# EasyEDA Pro project compute-module-v101.eprj, board adc-frontend-dif
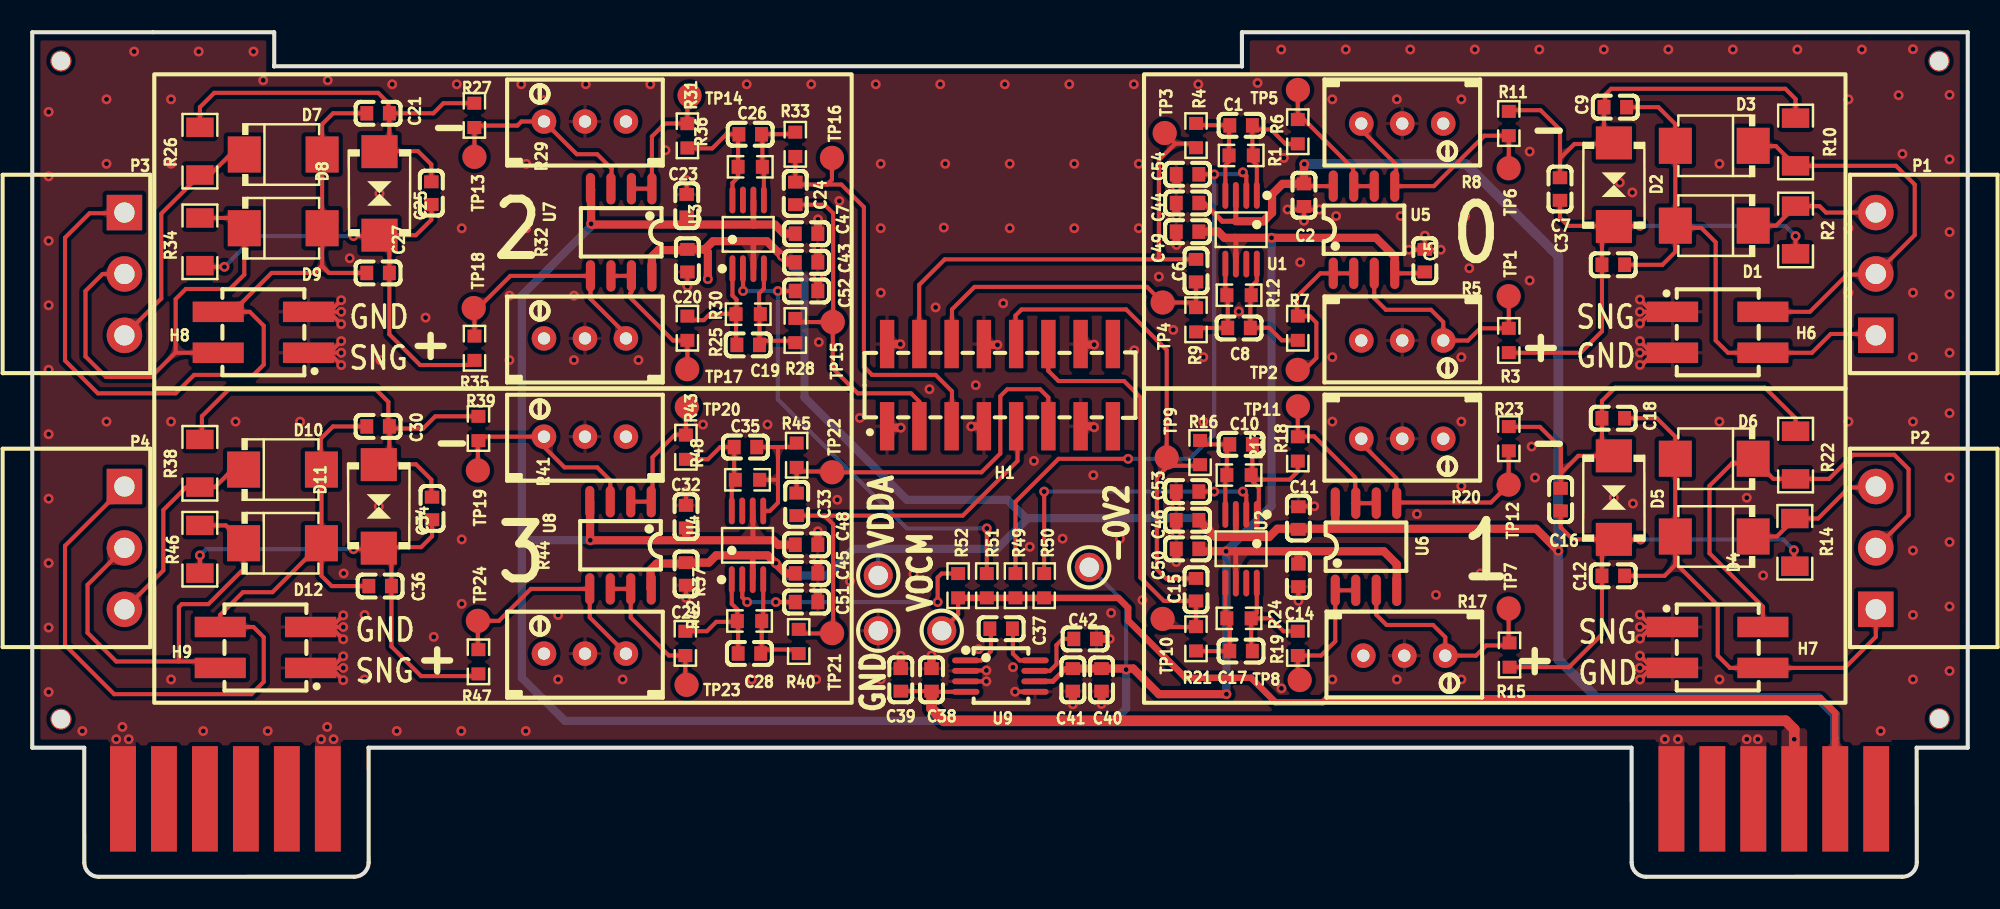
[diagram p10: board, top side]
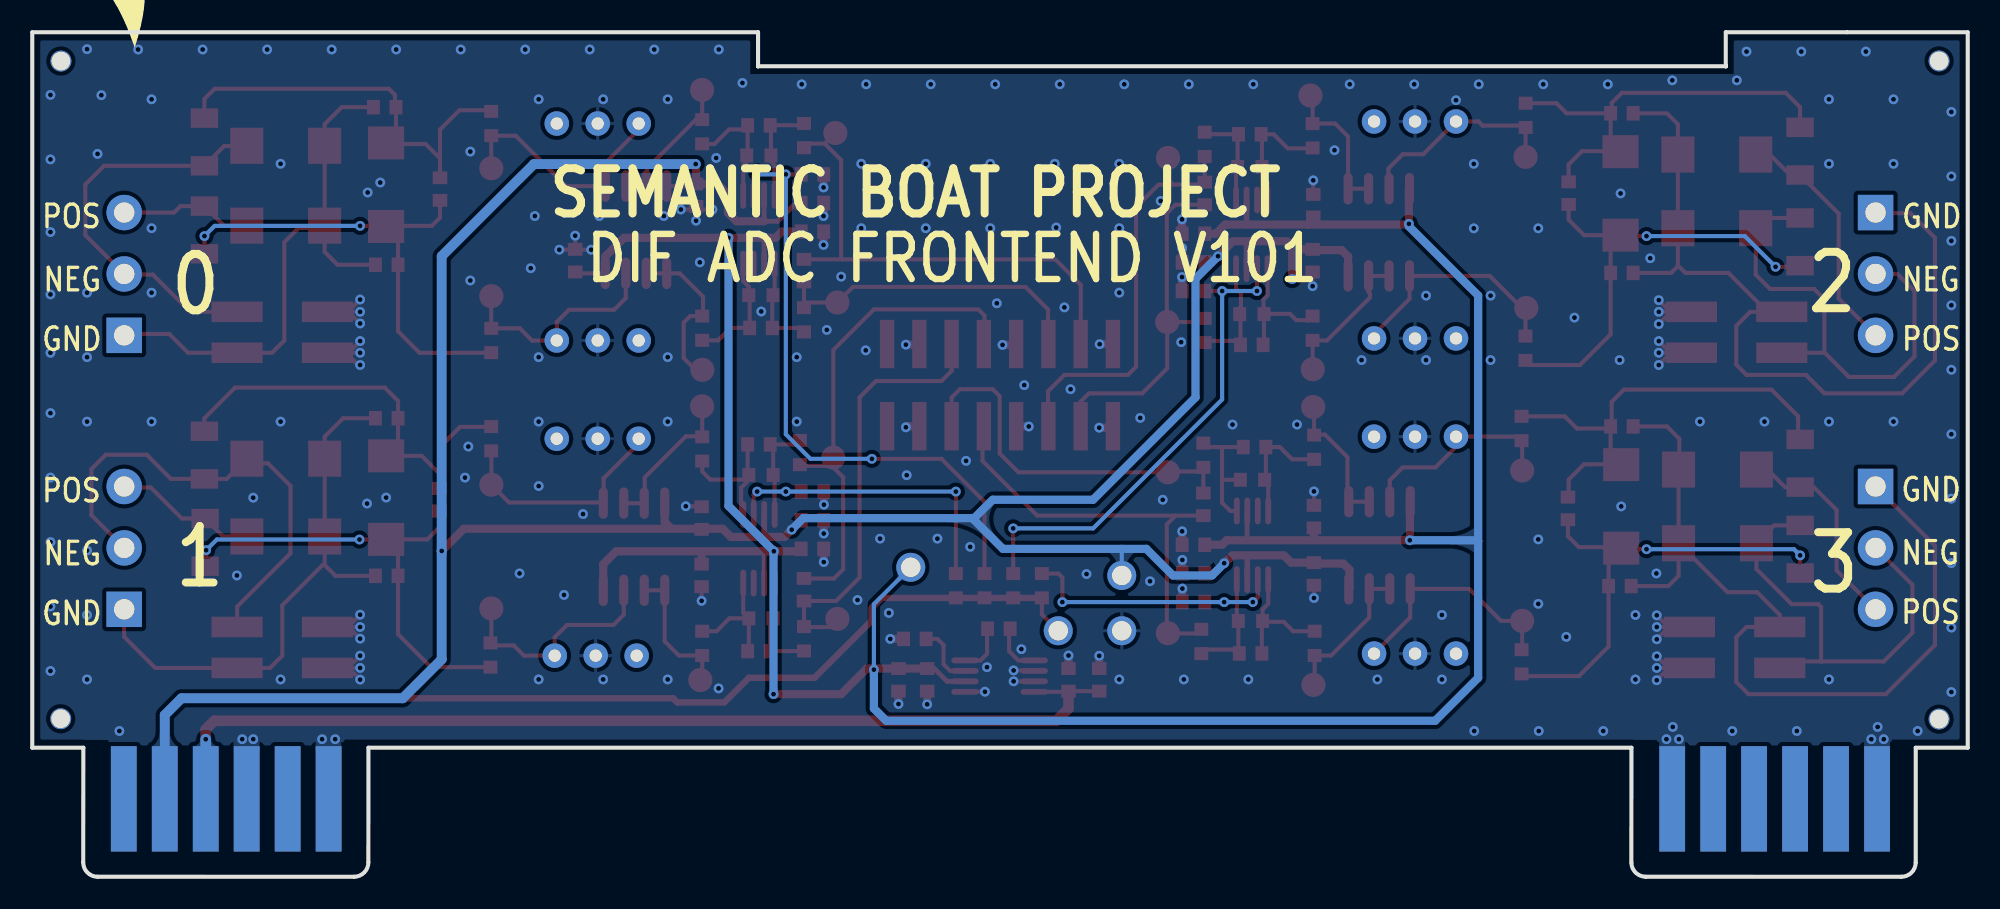
[diagram p11: board, bottom side, seen from below]

Outline 120 x 52.41 mm; copper layers: Top Layer, Inner1, Inner2, Bottom Layer. Coordinates in mm from the lower left corner of the outline.
Outline path: 75,50.3 15,50.3 15,52.41 0,52.41 0,8.01 3.22,8.01 3.23,0.89 arc(3.49,0.26) 4.11,0 19.96,0 arc(20.59,0.26) 20.86,0.89 20.85,8.01 99.16,8.01 99.16,0.89 arc(99.42,0.26) 100.05,0 115.95,0 arc(116.58,0.26) 116.84,0.89 116.83,8.01 120,8.01 120,52.41 75,52.41 75,50.3 ; 75,50.3 75,50.3 75,50.3
Stack: Top Layer 0.035mm Outer layer thickness 1oz / Dielectric1 0.2104mm 7628 RC49% 8.6mil / Inner1 0.0152mm Inner layer thickness / Dielectric2 1.065mm 1.1mm H/HOZ Copper / Inner2 0.0152mm Inner layer thickness / Dielectric3 0.2104mm 7628 RC49% 8.6mil / Bottom Layer 0.035mm Outer layer thickness 1oz

## Design rules (mm)
template: Custom Config
spacing copperThickness1oz (default): track to track 0.102, other pairs 0.152 to 0.3
spacing copperThickness2oz: track to track 0.203, other pairs 0.152 to 0.3
track width copperThickness1oz (default): min 0.127, default 0.254, max 2.54
track width copperThickness2oz: min 0.203, default 0.254, max 2.54
track width power: min 0.127, default 0.508, max 2.54
differential pair differentialPair (default): width min 0.127, default 0.254, max 2.54; gap min 0.152, default 0.152
via viaSize (default): diameter min 0.5, default 0.61, max 10; hole min 0.3, default 0.305, max 6.3
net GND uses power
net VOCM uses power
net VDDA uses power
net -0V23 uses power

## Placement (name value [footprint] x y rotation side)
C1  2.2nF  [C0603]  74.95 46.63 0 top
C2  100nF  [C0603]  78.84 42.3 270 top
C3  10nF  [C0603]  98.02 37.98 0 top
C5  100nF  [C0603]  86.34 38.23 90 top
C6  100pF  [C0603]  72.15 37.61 270 top
C7  10nF  [C0603]  94.72 42.68 270 top
C8  2.2nF  [C0603]  74.82 34.06 0 top
C9  10nF  [C0603]  98.15 47.76 180 top
C10  2.2nF  [C0603]  74.95 26.83 0 top
C11  100nF  [C0603]  78.5 22.26 90 top
C12  10nF  [C0603]  98.02 18.67 0 top
C14  100nF  [C0603]  78.5 18.7 270 top
C15  100pF  [C0603]  72.15 17.81 270 top
C16  10nF  [C0603]  94.76 23.4 270 top
C17  2.2nF  [C0603]  74.95 14 0 top
C18  10nF  [C0603]  98.02 28.45 180 top
C19  2.2nF  [C0603]  44.39 33.01 180 top
C20  100nF  [C0603]  40.62 38.23 270 top
C21  10nF  [C0603]  21.44 47.38 180 top
C23  100nF  [C0603]  40.58 41.64 90 top
C24  100pF  [C0603]  47.31 42.4 90 top
C25  10nF  [C0603]  24.74 42.42 90 top
C26  2.2nF  [C0603]  44.51 46.07 180 top
C27  10nF  [C0603]  21.44 37.47 0 top
C28  2.2nF  [C0603]  44.46 13.86 180 top
C29  100nF  [C0603]  40.53 18.79 270 top
C30  10nF  [C0603]  21.44 27.95 180 top
C32  100nF  [C0603]  40.53 22.35 90 top
C33  100pF  [C0603]  47.39 23.11 90 top
C34  10nF  [C0603]  24.79 22.86 90 top
C35  2.2nF  [C0603]  44.22 26.67 180 top
C36  10nF  [C0603]  21.57 18.04 0 top
C37  4.7uF  [C0603]  60.07 15.39 0 top
C38  10uF  [C0603]  55.75 12.22 270 top
C39  100nF  [C0603]  53.85 12.22 270 top
C40  470nF  [C0603]  66.29 12.22 90 top
C41  22uF  [C0603]  64.52 12.22 90 top
C42  22uF  [C0603]  65.28 14.76 180 top
C43  100nF  [C0603]  48.01 38.13 180 top
C44  100nF  [C0603]  71.63 41.81 0 top
C45  100nF  [C0603]  48.01 18.82 180 top
C46  100nF  [C0603]  71.63 22.13 0 top
C47  100nF  [C0603]  48.01 39.91 180 top
C48  100nF  [C0603]  48.01 20.6 180 top
C49  100nF  [C0603]  71.63 40.03 0 top
C50  100nF  [C0603]  71.63 20.35 0 top
C51  100nF  [C0603]  48.01 17.05 180 top
C52  100nF  [C0603]  48.01 36.35 180 top
C53  100nF  [C0603]  71.63 23.9 0 top
C54  100nF  [C0603]  71.63 43.59 0 top
D1  SMBJ28A  [SMB_L4.6-W3.6-LS5.4-RD]  104.28 40.41 180 top
D2  SMBJ28CA  [SMB_L4.6-W3.6-LS5.3-BI]  98.06 42.95 270 top
D3  SMBJ28A  [SMB_L4.6-W3.6-LS5.4-RD]  104.28 45.36 180 top
D4  SMBJ28A  [SMB_L4.6-W3.6-LS5.4-RD]  104.28 21.12 180 top
D5  SMBJ28CA  [SMB_L4.6-W3.6-LS5.3-BI]  98.06 23.53 270 top
D6  SMBJ28A  [SMB_L4.6-W3.6-LS5.4-RD]  104.28 25.94 180 top
D7  SMBJ28A  [SMB_L4.6-W3.6-LS5.4-RD]  15.56 44.82 0 top
D8  SMBJ28CA  [SMB_L4.6-W3.6-LS5.3-BI]  21.53 42.4 90 top
D9  SMBJ28A  [SMB_L4.6-W3.6-LS5.4-RD]  15.56 40.25 0 top
D10  SMBJ28A  [SMB_L4.6-W3.6-LS5.4-RD]  15.52 25.27 0 top
D11  SMBJ28CA  [SMB_L4.6-W3.6-LS5.3-BI]  21.48 22.98 90 top
D12  SMBJ28A  [SMB_L4.6-W3.6-LS5.4-RD]  15.52 20.7 0 top
H1  XDZ200-2-08-S-2.0-G1  [HDR-SMD_16P-P2.00-V-M-R2-C8-LS6.5]  60 30.51 0 top
H6  2.54-2*2P立贴针  [HDR-SMD_4P-P2.54-V-M-R2-C2-LS7.5]  104.5 33.79 270 top
H7  2.54-2*2P立贴针  [HDR-SMD_4P-P2.54-V-M-R2-C2-LS7.5]  104.5 14.23 270 top
H8  2.54-2*2P立贴针  [HDR-SMD_4P-P2.54-V-M-R2-C2-LS7.5]  14.33 33.79 90 top
H9  2.54-2*2P立贴针  [HDR-SMD_4P-P2.54-V-M-R2-C2-LS7.5]  14.46 14.23 90 top
NOREF  -  [Pad_e7469]  118.24 9.81 90 top
NOREF#2  -  [Pad_e7466]  1.78 9.78 0 top
NOREF#3  -  [Pad_e7468]  118.22 50.62 180 top
NOREF#4  -  [Pad_e7467]  1.78 50.62 270 top
P1  WJ15EDGRC-3.81-3P  [CONN-TH_3P-P3.81_WJ15EDGRC-3.81-3P]  114.3 37.41 90 top
P2  WJ15EDGRC-3.81-3P  [CONN-TH_3P-P3.81_WJ15EDGRC-3.81-3P]  114.3 20.41 90 top
P3  WJ15EDGRC-3.81-3P  [CONN-TH_3P-P3.81_WJ15EDGRC-3.81-3P]  5.72 37.41 270 top
P4  WJ15EDGRC-3.81-3P  [CONN-TH_3P-P3.81_WJ15EDGRC-3.81-3P]  5.72 20.41 270 top
R1  1kΩ  [R0603]  74.95 44.76 180 top
R2  100Ω  [R1206]  109.32 40.14 270 top
R3  1MΩ  [R0603]  91.54 33.28 90 top
R4  220Ω  [R0603]  72.15 45.99 90 top
R5  1MΩ  [RES-ADJ-TH_3296W]  84.94 33.28 270 top
R6  1kΩ  [R0603]  78.46 46.23 270 top
R7  1kΩ  [R0603]  78.46 34.04 270 top
R8  1MΩ  [RES-ADJ-TH_3296W]  84.94 46.74 270 top
R9  220Ω  [R0603]  72.15 34.56 270 top
R10  100Ω  [R1206]  109.32 45.6 90 top
R11  1MΩ  [R0603]  91.54 46.74 270 top
R12  1kΩ  [R0603]  74.82 36.09 180 top
R13  1kΩ  [R0603]  74.82 24.93 180 top
R14  100Ω  [R1206]  109.28 20.75 270 top
R15  1MΩ  [R0603]  91.59 13.76 90 top
R16  220Ω  [R0603]  72.41 26.32 90 top
R17  1MΩ  [RES-ADJ-TH_3296W]  85.07 13.72 270 top
R18  1kΩ  [R0603]  78.46 26.55 270 top
R19  1kΩ  [R0603]  78.46 14.48 90 top
R20  1MΩ  [RES-ADJ-TH_3296W]  84.94 27.18 270 top
R21  220Ω  [R0603]  72.15 14.77 270 top
R22  100Ω  [R1206]  109.32 26.17 90 top
R23  1MΩ  [R0603]  91.54 27.18 270 top
R24  1kΩ  [R0603]  74.82 16.04 180 top
R25  1kΩ  [R0603]  44.39 34.91 0 top
R26  100Ω  [R1206]  10.4 45.03 90 top
R27  1MΩ  [R0603]  27.41 47.25 270 top
R28  220Ω  [R0603]  47.31 33.9 270 top
R29  1MΩ  [RES-ADJ-TH_3296W]  34.27 46.87 90 top
R30  1kΩ  [R0603]  40.62 34.04 90 top
R31  1kΩ  [R0603]  40.62 45.98 270 top
R32  1MΩ  [RES-ADJ-TH_3296W]  34.27 33.41 90 top
R33  220Ω  [R0603]  47.31 45.45 90 top
R34  100Ω  [R1206]  10.4 39.4 270 top
R35  1MΩ  [R0603]  27.42 32.8 90 top
R36  1kΩ  [R0603]  44.51 44.06 0 top
R37  1kΩ  [R0603]  44.47 15.87 0 top
R38  100Ω  [R1206]  10.39 25.66 90 top
R39  1MΩ  [R0603]  27.66 27.82 270 top
R40  220Ω  [R0603]  47.52 14.6 270 top
R41  1MΩ  [RES-ADJ-TH_3296W]  34.27 27.31 90 top
R42  1kΩ  [R0603]  40.49 14.48 90 top
R43  1kΩ  [R0603]  40.53 26.66 270 top
R44  1MΩ  [RES-ADJ-TH_3296W]  34.27 13.85 90 top
R45  220Ω  [R0603]  47.39 26.16 90 top
R46  100Ω  [R1206]  10.39 20.33 270 top
R47  1MΩ  [R0603]  27.66 13.34 90 top
R48  1kΩ  [R0603]  44.34 24.63 0 top
R49  100Ω  [R0603]  60.96 18.06 270 top
R50  100Ω  [R0603]  62.74 18.06 270 top
R51  100Ω  [R0603]  59.18 18.06 270 top
R52  100Ω  [R0603]  57.4 18.06 270 top
TP1  -  [Test-Point-0.5mm]  91.54 36.03 180 top
TP2  -  [Test-Point-0.5mm]  78.46 31.46 180 top
TP3  -  [Test-Point-0.5mm]  70.21 46.15 180 top
TP4  -  [Test-Point-0.5mm]  70.08 35.63 180 top
TP5  -  [Test-Point-0.5mm]  78.47 48.83 180 top
TP6  -  [Test-Point-0.5mm]  91.54 43.96 180 top
TP7  -  [Test-Point-0.5mm]  91.54 16.65 180 top
TP8  -  [Test-Point-0.5mm]  78.58 12.21 180 top
TP9  -  [Test-Point-0.5mm]  70.33 26.01 180 top
TP10  -  [Test-Point-0.5mm]  70.08 16 180 top
TP11  -  [Test-Point-0.5mm]  78.47 29.19 180 top
TP12  -  [Test-Point-0.5mm]  91.54 24.33 180 top
TP13  -  [Test-Point-0.5mm]  27.42 44.67 0 top
TP14  -  [Test-Point-0.5mm]  40.75 48.48 0 top
TP15  -  [Test-Point-0.5mm]  49.63 34.42 0 top
TP16  -  [Test-Point-0.5mm]  49.58 44.61 0 top
TP17  -  [Test-Point-0.5mm]  40.61 31.49 0 top
TP18  -  [Test-Point-0.5mm]  27.37 35.29 0 top
TP19  -  [Test-Point-0.5mm]  27.63 25.21 0 top
TP20  -  [Test-Point-0.5mm]  40.58 29.15 0 top
TP21  -  [Test-Point-0.5mm]  49.59 15.11 0 top
TP22  -  [Test-Point-0.5mm]  49.59 25.1 0 top
TP23  -  [Test-Point-0.5mm]  40.57 11.91 0 top
TP24  -  [Test-Point-0.5mm]  27.63 15.88 0 top
TP25  RH-5004  [TESTPOINT_TH_BD2.5-D1.2]  52.45 18.7 270 top
TP26  RH-5004  [TESTPOINT_TH_BD2.5-D1.2]  56.39 15.27 270 top
TP27  RH-5004  [TESTPOINT_TH_BD2.5-D1.2]  65.53 19.2 270 top
TP28  RH-5004  [TESTPOINT_TH_BD2.5-D1.2]  52.45 15.27 270 top
U1  THS4521IDGKR  [VSSOP-8_L3.0-W3.0-P0.65-LS5.0-BL]  74.95 40.15 180 top
U2  THS4521IDGKR  [VSSOP-8_L3.0-W3.0-P0.65-LS5.0-BL]  74.95 20.35 180 top
U3  THS4521IDGKR  [VSSOP-8_L3.0-W3.0-P0.65-LS5.0-BL]  44.39 39.86 0 top
U4  THS4521IDGKR  [VSSOP-8_L3.0-W3.0-P0.65-LS5.0-BL]  44.34 20.57 0 top
U5  TLV9062IDR  [SOIC-8_L5.0-W4.0-P1.27-LS6.0-BL]  82.57 40.15 0 top
U6  TLV9062IDR  [SOIC-8_L5.0-W4.0-P1.27-LS6.0-BL]  82.69 20.48 0 top
U7  TLV9062IDR  [SOIC-8_L5.0-W4.0-P1.27-LS6.0-BL]  36.51 39.99 180 top
U8  TLV9062IDR  [SOIC-8_L5.0-W4.0-P1.27-LS6.0-BL]  36.47 20.57 180 top
U9  LM7705MM/NOPB  [MSOP-8_L3.0-W3.0-P0.65-LS5.0-BL]  60.02 12.45 270 top
U23  -  [ED12BGFBK-CARD]  108 0.01 0 top
U24  -  [ED12BGFBK-CARD]  12 0.01 0 top

## Footprints (pads in the part's own frame, mm; a bottom-side part is the same pattern mirrored in y, then rotated)
C0603
  rect 0.8x0.9 smd: 1(-0.7,0) 2(0.7,0)
CONN-TH_3P-P3.81_WJ15EDGRC-3.81-3P
  rect 2.2x2.2 hole 1.26: 1(-3.81,0)
  round 2.2 hole 1.26: 2(0,0) 3(3.81,0)
ED12BGFBK-CARD
  rect 1.6x6.54 smd far side: 1(-6.375,4.826) 2(-3.835,4.826) 3(-1.295,4.826) 4(1.245,4.826) 5(3.785,4.826) 6(6.325,4.826)
  rect 1.6x6.54 smd: 7(6.325,4.826) 8(3.785,4.826) 9(1.245,4.826) 10(-1.295,4.826) 11(-3.835,4.826) 12(-6.375,4.826)
HDR-SMD_4P-P2.54-V-M-R2-C2-LS7.5
  rect 1.27x3.17 smd: 1(-1.27,-2.8) 2(-1.27,2.8) 3(1.27,-2.8) 4(1.27,2.8)
HDR-SMD_16P-P2.00-V-M-R2-C8-LS6.5
  rect 0.89x3 smd: 1(-7,-2.55) 2(-7,2.55) 3(-5,-2.55) 4(-5,2.55) 5(-3,-2.55) 6(-3,2.55) 7(-1,-2.55) 8(-1,2.55) 9(1,-2.55) 10(1,2.55) 11(3,-2.55) 12(3,2.55) 13(5,-2.55) 14(5,2.55) 15(7,-2.55) 16(7,2.55)
MSOP-8_L3.0-W3.0-P0.65-LS5.0-BL
  oval 0.364x1.692 smd: 1(-0.975,-2.146) 2(-0.325,-2.146) 3(0.325,-2.146) 4(0.975,-2.146) 5(0.975,2.146) 6(0.325,2.146) 7(-0.325,2.146) 8(-0.975,2.146)
Pad_e7466
  round 1.3 hole 1.152: 1(0,0)
Pad_e7467
  round 1.3 hole 1.152: 1(0,0)
Pad_e7468
  round 1.3 hole 1.152: 1(0,0)
Pad_e7469
  round 1.3 hole 1.152: 1(0,0)
R0603
  rect 0.806x0.864 smd: 1(-0.753,0) 2(0.753,0)
R1206
  rect 1.208x1.701 smd: 1(-1.479,0) 2(1.479,0)
RES-ADJ-TH_3296W
  round 1.524 hole 0.762: 1(0,2.54) 2(0,0) 3(0,-2.54)
SMB_L4.6-W3.6-LS5.3-BI
  rect 2.047x2.241 smd: 1(-2.591,0) 2(2.591,0)
SMB_L4.6-W3.6-LS5.4-RD
  rect 2.047x2.241 smd: 1(-2.413,0) 2(2.413,0)
SOIC-8_L5.0-W4.0-P1.27-LS6.0-BL
  oval 0.569x1.95 smd: 1(-1.905,-2.705) 2(-0.635,-2.705) 3(0.635,-2.705) 4(1.905,-2.705) 5(1.905,2.705) 6(0.635,2.705) 7(-0.635,2.705) 8(-1.905,2.705)
Test-Point-0.5mm
  round 1.5 smd: 1(0,0)
TESTPOINT_TH_BD2.5-D1.2
  round 1.8 hole 1.2: 1(0,0)
VSSOP-8_L3.0-W3.0-P0.65-LS5.0-BL
  oval 0.364x1.662 smd: 1(-0.975,-2.131) 2(-0.325,-2.131) 3(0.325,-2.131) 4(0.975,-2.131) 5(0.975,2.131) 6(0.325,2.131) 7(-0.325,2.131) 8(-0.975,2.131)

## Nets
As in the schematic.

Pads without a net: H1 15 16; NOREF 1; NOREF#2 1; NOREF#3 1; NOREF#4 1; R5 3; R8 1; R17 3; R20 1; R29 3; R32 1; R41 3; R44 1; U1 7; U2 7; U3 7; U4 7; U23 2 6 7 11; U24 2 3 4 5 8 9 10 11

## Via types
v1: diameter 0.61, hole 0.305, Top Layer to Bottom Layer, 282 vias

## Routing (per net, layer and track width the routed paths; a pad name or vN(x,y) marks a point on that pad's centre or on a via; arc(x,y) is an arc through that point)
+3V3: length 67.2
  Top Layer w0.254: U9.4 55.8,11.48 C38.2 C39.2
  Top Layer w0.66: C38.2 55.75,10.44 56.51,9.68 108.71,9.68 109.25,9.15 v1(109.25,8.54) U23.4
  Bottom Layer w0.66: U23.4 v1(109.25,8.54)
-0V23: length 194.5
  Top Layer w0.254: C5.1 86.25,37.45 U5.4
  Top Layer w0.305: 44.68,20.96 44.68,22.69 U4.6 ; U1.6 74.62,39.61 74.59,39.65 ; 74.62,20.2 U2.6 ; U9.6 63.28,12.13 64.07,12.92 C41.2
  Top Layer w0.35: 44.73,40.47 44.71,40.49 U3.6
  Top Layer w0.508: U5.4 84.47,38.49 83.31,39.65 73.92,39.65 73.53,40.03 C49.2 ; 78.51,20.2 v1(74.02,20.2) 72.48,20.2 C50.2 ; 78.51,20.2 78.5,20.19 C14.1 ; 78.51,20.2 83.8,20.2 84.6,19.4 U6.4 ; C41.2 C40.2 68.26,12.92 69.85,11.33 v1(74.04,11.33) ; C23.1 40.58,40.82 40.92,40.47 ; C32.1 40.53,20.98 ; U8.4 34.58,23.26 34.58,20.89 v1(34.59,20.88) 45.95,20.88 46.23,20.6 C48.2 ; C47.2 46.61,39.91 46.04,40.47 40.92,40.47 ; 40.92,40.47 34.69,40.47 v1(34.65,40.52) 34.65,42.66 U7.4
  Bottom Layer w0.254: v1(67.82,12.85) 67.82,16.92 TP27.1
  Bottom Layer w0.508: v1(67.82,12.85) 67.82,10.44 67.06,9.68 33.02,9.68 30.35,12.35 30.35,20.82 ; v1(76.84,39.65) 76.84,23.01 v1(74.02,20.2) 74.04,20.18 v1(74.04,11.33) ; v1(34.65,40.52) 34.65,40.37 30.35,36.07 30.35,20.82 ; 30.35,20.82 30.42,20.88 v1(34.59,20.88)
GND: length 67.2
  Top Layer w0.254: v1(19.28,13.68) 18.56,12.96 ; 18.56,12.96 v1(19.28,12.96) ; 18.56,12.96 18.52,12.96 ; C2.2 79.03,41.41 v1(79.79,41.41) ; C2.2 v1(78.84,40.71) ; C2.2 78.66,41.41 v1(77.83,41.41) ; 18.52,12.96 H9.1 ; 18.52,12.96 v1(19.28,12.2) ; v1(19.16,31.76) 18.39,32.52 ; 18.39,32.52 18.43,32.52 ; 18.39,32.52 H8.1 ; 18.52,15.5 H9.3 ; 18.52,15.5 18.56,15.5 ; 18.52,15.5 v1(19.28,14.74) ; 18.43,32.52 v1(19.16,32.52) ; 18.43,32.52 v1(19.16,33.24) ; v1(86.34,39.78) C5.2 ; C5.2 86.32,38.91 v1(85.35,38.91) ; C5.2 86.36,38.91 v1(87.32,38.91) ; U9.5 62.16,11.48 v1(60.93,11.48) ; 18.56,15.5 v1(19.28,15.5) ; 18.56,15.5 v1(19.28,16.22) ; v1(99.67,34.33) 100.4,35.06 v1(99.67,35.06) ; 100.44,12.96 101.7,12.96 ; 100.44,12.96 v1(99.67,13.72) ; 100.44,12.96 100.4,12.96 ; v1(99.67,12.96) 100.4,12.96 ; 100.4,12.96 v1(99.67,12.24) ; 18.43,35.06 18.39,35.06 ; 18.43,35.06 v1(19.16,35.06) ; 18.43,35.06 v1(19.16,35.78) ; 18.39,35.06 H8.3 ; 18.39,35.06 v1(19.16,34.3) ; v1(79.48,22.99) 78.53,22.99 C11.2 ; 59.16,12.13 U9.3 ; v1(40.58,43.22) C23.2 ; 100.4,32.52 100.56,32.52 ; 100.4,32.52 v1(99.67,32.52) ; 100.4,32.52 v1(99.67,33.24) ; 100.56,32.52 99.8,31.76 v1(99.67,31.76) ; 100.56,32.52 101.7,32.52 ; v1(40.53,17.3) C29.2 ; v1(99.67,35.82) 100.44,35.06 101.7,35.06 ; v1(99.67,16.26) 100.44,15.5 101.7,15.5 ; U9.2 57.91,12.8 v1(59.16,12.8) ; v1(99.67,14.78) 100.4,15.5 v1(99.67,15.5) ; v1(78.5,17.12) C14.2 ; v1(40.53,23.91) C32.2 ; v1(40.62,36.65) C20.2
  Top Layer w0.508: v1(70.93,21.3) C46.1 ; v1(70.93,19.53) C50.1 ; C51.1 48.71,17.87 v1(48.69,17.88) ; v1(53.85,13.71) C39.1 ; H1.2 53.81,33.06 v1(53.82,33.05) ; v1(48.71,39.01) C43.1 ; C53.1 70.92,23.89 v1(70.92,23.09) ; v1(48.72,37.21) 48.72,36.36 C52.1 ; v1(48.71,21.44) C48.1 ; C49.1 70.94,40.02 v1(70.94,39.21) ; H1.7 58.23,27.96 v1(58.22,27.94) ; v1(65.84,33.02) 65.04,33.02 H1.14 ; C54.1 70.94,43.57 v1(70.94,42.78) ; v1(64.52,10.7) C41.1 ; v1(66.8,14.76) C42.1 ; H1.13 65.77,27.96 v1(65.84,27.89) ; v1(59.84,33.01) 59.05,33.01 H1.8 ; v1(66.29,10.72) C40.1 ; v1(48.72,40.79) 48.72,39.92 C47.1 ; C44.1 70.93,41.01 v1(70.94,41) ; v1(55.75,13.73) C38.1 ; v1(48.69,19.66) 48.71,19.65 C45.1 ; H1.1 53.09,27.87 v1(53.85,27.87)
  vias: v1(1.02,47.46) v1(1.02,43.46) v1(1.02,39.46) v1(1.02,35.46) v1(1.02,31.46) v1(1.02,27.46) v1(1.02,23.46) v1(1.02,19.46) v1(1.02,15.46) v1(1.02,11.46) v1(3.11,9.04) v1(4.6,48.25) v1(4.6,44.25) v1(4.6,28.25) v1(5.21,8.54) v1(5.59,9.3) v1(5.98,8.54) v1(6.32,51.21) v1(8.6,48.25) v1(8.6,44.25) v1(8.6,28.25) v1(8.6,12.25) v1(10.32,51.21) v1(10.6,9.04) v1(12.6,28.25) v1(13.72,51.21) v1(14.32,49.42) v1(14.6,9.04) v1(16.6,28.25) v1(17.91,8.54) v1(18.32,49.42) v1(18.29,9.3) v1(18.68,8.54) v1(19.3,18.82) v1(19.69,38.38) v1(20.6,16.25) v1(20.6,12.25) v1(21.53,42.4) v1(21.48,22.98) v1(21.58,32.06) v1(22.32,49.18) v1(22.6,9.04) v1(24.38,34.7) v1(24.89,14.89) v1(26.32,49.18) v1(26.63,40.24) v1(26.63,20.94) v1(26.63,16.94) v1(26.6,9.04) v1(29.58,36.06) v1(29.58,32.06) v1(30.32,49.18) v1(30.63,44.24) v1(30.63,40.24) v1(30.6,9.04) v1(31.73,48.19) v1(32.6,16.25) v1(32.6,12.25) v1(33.58,36.06) v1(33.58,32.06) v1(34.32,49.18) v1(36.6,12.25) v1(37.58,32.06) v1(38.32,49.18) v1(39.26,45.08) v1(41.59,28.06) v1(44.3,49.18) v1(44.6,12.25) v1(45.59,28.06) v1(48.3,49.18) v1(48.6,12.25) v1(48.77,33.17) v1(49.91,23.4) v1(50.04,41.94) v1(50.7,18.34) v1(51.31,28.48) v1(52.3,49.18) v1(52.6,44.25) v1(52.6,40.25) v1(52.6,36.25) v1(52.6,12.25) v1(54.64,18.79) v1(55.63,30.25) v1(56.01,35.33) v1(56.3,49.18) v1(56.51,40.29) v1(56.6,44.25) v1(58.5,30.51) v1(58.67,14.12) v1(59.16,12.13) v1(60.2,35.59) v1(60.3,49.18) v1(60.6,44.25) v1(60.6,40.25) v1(60.81,13.01) v1(61.85,20.47) v1(62.1,25.81) v1(63.88,20.98) v1(64.3,49.18) v1(64.6,44.25) v1(64.6,40.25) v1(65.79,24.92) v1(66.89,16.37) v1(67.44,20.98) v1(68.3,49.18) v1(68.33,32.67) v1(68.6,44.25) v1(68.6,40.25) v1(68.83,17.17) v1(69.85,37.24) v1(70.74,33.94) v1(72.3,49.18) v1(72.6,32.25) v1(72.6,28.25) v1(74.8,35.08) v1(75.97,49.26) v1(77.44,51.34) v1(77.45,11.69) v1(77.6,44.6) v1(78.61,38.13) v1(80.6,48.25) v1(80.6,32.25) v1(80.6,28.25) v1(80.6,12.25) v1(80.84,41) v1(81.44,51.34) v1(84.6,48.25) v1(84.6,12.25) v1(84.84,41) v1(85.44,51.34) v1(85.85,22.51) v1(87.03,17.49) v1(88.6,48.25) v1(88.6,32.25) v1(88.6,28.25) v1(88.6,24.25) v1(88.6,12.25) v1(88.84,41) v1(89.09,37.76) v1(89.44,51.34) v1(89.79,18.82) v1(92.84,45) v1(92.84,37) v1(92.96,26.7) v1(93.17,24.77) v1(93.44,51.34) v1(97.44,51.34) v1(98.06,23.53) v1(98.43,43.08) v1(99.21,42.46) v1(99.24,23.16) v1(101.22,8.54) v1(101.44,51.34) v1(102.03,8.54) v1(104.6,44.25) v1(104.6,28.25) v1(104.6,12.25) v1(105.44,51.34) v1(106.3,23.52) v1(106.3,8.54) v1(106.98,8.54) v1(107.31,18.7) v1(109.44,51.34) v1(112.6,48.25) v1(112.6,40.25) v1(112.6,36.25) v1(112.6,28.25) v1(113.44,51.34) v1(114.6,9.04) v1(115.72,48.5) v1(115.95,44.86) v1(116.6,51.36) v1(116.6,36.25) v1(116.6,32.25) v1(116.6,28.25) v1(116.6,20.25) v1(116.6,16.25) v1(116.6,12.25) v1(118.87,48.52) v1(118.87,44.52) v1(118.87,40.01) v1(118.87,36.14) v1(118.87,32.52) v1(118.87,28.77) v1(118.87,24.77) v1(118.87,20.77) v1(118.87,16.77) v1(118.87,12.77)
VDDA: length 191
  Top Layer w0.254: C2.1 78.98,42.86 U5.8
  Top Layer w0.305: C44.2 72.64,41.81 73.78,40.68 74.62,40.68 U1.3
  Top Layer w0.35: U3.3 44.71,39.44 ; 44.67,19.94 44.67,19.94 U4.3 ; 74.62,21.09 U2.3
  Top Layer w0.508: 41.7,38.93 41.89,38.74 v1(41.89,37.09) ; 41.7,38.93 C20.1 40.57,38.89 38.82,38.89 38.42,38.49 U7.8 ; 41.7,38.93 42.21,39.44 45.55,39.44 46.48,38.51 ; U6.8 80.79,22.01 80.37,21.6 ; C46.2 v1(72.92,21.54) 73.37,21.09 76.69,21.09 77.19,21.6 78.47,21.6 C11.1 78.54,21.6 80.37,21.6 ; v1(78.87,44.22) 78.84,44.2 C2.1 77.51,43 76.87,42.35 76.87,41.21 76.34,40.68 74.62,40.68 ; v1(46.48,38.51) 46.86,38.13 C43.2 ; 80.37,21.6 93.24,21.6 v1(94.62,20.22) ; 38.38,17.86 38.33,17.91 38.33,19.06 38.71,19.44 40.48,19.44 C29.1 41.94,19.49 42.4,19.94 45.59,19.94 46.72,18.81 47.29,18.81 C45.2
  Bottom Layer w0.254: 52.45,20.35 TP25.1
  Bottom Layer w0.508: v1(72.92,21.54) 72.2,22.25 61.72,22.25 ; 61.72,22.25 59.82,20.35 50.93,20.35 49.28,18.7 46.86,18.7 v1(46.1,19.46) ; 61.72,22.25 61.59,22.25 60.45,23.4 54.23,23.4 47.88,29.75 47.88,37.11 v1(46.48,38.51)
  Bottom Layer w0.61: v1(78.87,44.22) 88.9,44.22 94.62,38.51 v1(94.62,20.22) 94.62,13.49 97.03,11.08 110.74,11.08 111.78,10.04 U23.5
ADIF_IN_GND_0: length 34.6
  Top Layer w0.254: C9.1 100.82,47.76 101.87,46.7 D3.2 D1.2 ; D1.2 102.01,40.26 103.48,40.26 104.37,39.38 104.37,33.28 105.13,32.52 H6.4 110.34,32.52 111.51,33.68 114.22,33.68 P1.1 ; D1.2 101.87,38.78 101.07,37.98 C3.2
ADIF_IN_GND_1: length 34.4
  Top Layer w0.254: 101.87,19.35 102,19.35 104.5,16.84 104.5,13.72 105.26,12.96 H7.4 112.37,12.96 114.3,14.89 P2.1 ; 101.87,19.35 D4.2 D6.2 101.87,27.31 100.73,28.45 C18.1 ; 101.87,19.35 101.2,18.67 C12.2
ADIF_IN_GND_2: length 53
  Top Layer w0.254: C27.1 18.39,37.47 17.97,37.89 17.97,37.94 ; 12.42,35.06 13.48,35.06 14.35,34.19 14.35,31.78 13.72,31.14 10.03,31.14 8.89,30 4.06,30 2.03,32.03 2.03,39.65 3.56,41.18 5.67,41.18 P3.1 ; 12.42,35.06 H8.4 ; 12.42,35.06 14.84,37.47 17.5,37.47 17.97,37.94 ; 17.97,37.94 D9.2 D7.2 17.97,46.7 18.65,47.38 C21.2
ADIF_IN_GND_3: length 54.8
  Top Layer w0.254: D12.2 D10.2 17.89,25.31 17.89,27.18 18.65,27.95 C30.2 ; D12.2 14.89,17.66 13.06,17.66 11.66,16.26 H9.4 13.72,15.5 14.35,14.86 14.35,12.09 13.59,11.33 5.08,11.33 2.03,14.38 2.03,20.53 P4.1 ; D12.2 17.93,18.67 18.56,18.04 C36.1
ADIF_IN_N_0: length 25.5
  Top Layer w0.254: D3.1 106.71,45.34 108.1,45.34 R10.1 115.55,44.12 116.71,42.95 116.71,39.82 P1.2 114.26,37.37 112.52,37.37 110.21,35.06 H6.2
ADIF_IN_N_1: length 30.4
  Top Layer w0.254: H7.2 107.3,16.76 103.99,20.07 103.99,24.26 105.39,25.66 106.41,25.66 D6.1 107.95,24.69 R22.1 111.4,24.69 112.9,26.19 115.44,26.19 116.33,25.3 116.33,22.44 P2.2
ADIF_IN_N_2: length 30.4
  Top Layer w0.254: 8.87,32.52 7.37,31.02 4.57,31.02 3.3,32.29 3.3,36.35 4.36,37.41 P3.2 ; 8.87,32.52 8.89,32.54 8.89,35.84 9.53,36.48 12.26,36.48 13.14,37.37 13.14,40.25 12.51,40.88 R34.1 ; 8.87,32.52 H8.2
ADIF_IN_N_3: length 28.5
  Top Layer w0.254: P4.2 3.43,18.12 3.43,15.14 5.21,13.36 9.07,13.36 ; 9.07,13.36 11.25,13.36 H9.2 ; 9.07,13.36 9.09,13.39 9.09,16.74 9.27,16.92 10.92,16.92 13.1,19.1 D12.1 12,21.8 R46.1
ADIF_IN_P_0: length 8.3
  Top Layer w0.254: P1.3 111.21,41.22 110.81,41.62 R2.1 108.12,40.41 D1.1
ADIF_IN_P_1: length 8.9
  Top Layer w0.254: P2.3 114.24,24.16 112.65,24.16 110.72,22.23 109.28,22.23 108.17,21.12 D4.1
ADIF_IN_P_2: length 15.2
  Top Layer w0.254: P3.3 8,35.88 8,41.15 R26.1 11.01,43.55 12.28,44.82 13.14,44.82
ADIF_IN_P_3: length 13.2
  Top Layer w0.254: D10.1 12.41,25.27 11.33,24.18 R38.1 10.37,24.16 9.53,24.16 8.13,22.76 8.13,19.01 P4.3
ADIF_N_0: length 19.9
  Top Layer w0.254: H1.6 57.02,33.08 57.02,35.21 58.42,36.6 69.11,36.6 TP4.1 72.09,35.63 72.15,35.57 72.15,37.17
ADIF_N_1: length 27
  Top Layer w0.254: 70.08,15.49 72.13,15.49 R21.1 72.15,17.11 70.16,17.11 68.71,18.57 68.71,29.75 67.69,30.76 63.63,30.76 62.99,31.4 62.99,33.05 H1.12
ADIF_N_2: length 26.4
  Top Layer w0.254: 49.28,42.95 47.35,42.95 47.31,43 47.31,44.57 ; 49.28,42.95 50.16,42.95 51.56,41.56 51.56,31.65 52.07,31.14 56.01,31.14 57.02,30.13 57.02,27.98 H1.5 ; 49.28,42.95 49.58,43.26 TP16.1
ADIF_N_3: length 23.2
  Top Layer w0.254: H1.11 63,29.74 62.48,30.25 60.45,30.25 60.02,29.82 60.02,26.27 58.85,25.1 TP22.1 49.54,25.15 47.39,25.15 C33.2
ADIF_P_0: length 31.3
  Top Layer w0.254: 70.87,45.49 TP3.1 ; 70.87,45.49 69.85,44.48 69.85,38.35 69.81,38.31 ; 70.87,45.49 72.15,45.49 ; 69.81,38.31 56.57,38.31 54.99,36.73 54.99,33.07 H1.4 ; 69.81,38.31 C6.1
ADIF_P_1: length 30.5
  Top Layer w0.254: R16.1 72.34,25.5 70.33,25.5 70.33,25.4 69.72,24.79 69.72,19.08 70.29,18.51 72.14,18.51 C15.1 ; H1.10 60.96,33.1 60.96,34.83 61.34,35.21 67.82,35.21 70.33,32.69 TP9.1
ADIF_P_2: length 22.5
  Top Layer w0.254: C24.1 49.13,41.7 49.66,41.18 49.66,34.19 49.63,34.17 ; 49.63,34.17 TP15.1 47.34,34.42 47.31,34.4 ; 49.63,34.17 49.63,31.55 51.18,30 54.48,30 55,29.48 H1.3
ADIF_P_3: length 26.9
  Top Layer w0.254: 47.52,15.1 49.58,15.1 TP21.1 49.66,15.18 49.66,21.87 49.12,22.41 ; 49.12,22.41 C33.1 ; 49.12,22.41 57.69,22.41 61.09,25.81 61.09,27.87 H1.9
VOCM: length 65.8
  Top Layer w0.254: R52.2 57.4,16.28 TP26.1
  Top Layer w0.4: 57.41,17.3 67.34,17.3 67.94,16.69 67.94,15.9 71.5,12.35 75.56,12.35 77.09,10.82 80.01,10.82 80.26,11.08 110.87,11.08 111.78,10.16 U23.8
  Top Layer w0.508: 60.96,17.3 R49.2
  Top Layer w0.61: 57.41,17.3 R52.2
VOCM_0: length 38.9
  Top Layer w0.254: U1.2 75.27,43.5 v1(75.06,43.72) ; R49.1 60.96,23.27 63.63,25.94 v1(67.94,25.94) ; C54.2 v1(73.28,43.59)
  Bottom Layer w0.254: v1(75.06,43.72) 74.93,43.59 v1(73.28,43.59) 73.28,27.46 71.75,25.94 v1(67.94,25.94)
VOCM_1: length 19.9
  Top Layer w0.254: v1(75.06,23.9) 75.27,23.69 U2.2 ; R50.1 v1(62.74,23.9) ; C53.2 v1(73.28,23.9)
  Bottom Layer w0.254: v1(75.06,23.9) v1(73.28,23.9) v1(62.74,23.9)
VOCM_2: length 30.4
  Top Layer w0.254: U3.2 44.07,37.73 v1(44.07,36.35) ; C52.2 v1(46.23,36.35) ; R51.1 v1(59.18,21.62)
  Bottom Layer w0.254: v1(59.18,21.62) 54.23,21.62 46.23,29.62 v1(46.23,36.35) v1(44.07,36.35)
VOCM_3: length 17.4
  Top Layer w0.254: v1(56.13,17.05) 56.13,18.57 56.38,18.82 R52.1 ; v1(44.32,17.05) 44.02,17.35 U4.2 ; C51.2 v1(46.1,17.05)
  Bottom Layer w0.254: v1(44.32,17.05) v1(46.1,17.05) v1(56.13,17.05)
$1N1032: length 27.1
  Top Layer w0.254: R11.1 91.62,47.57 93.51,47.57 94.72,46.36 94.72,44.58 ; C7.1 94.72,44.58 ; 94.72,44.58 95.61,45.47 98,45.47 D2.1 97.45,46.15 C9.2 97.51,47.82 97.51,48.52 97.9,48.9 108.69,48.9 109.32,48.27 R10.2
$1N1039: length 30.4
  Top Layer w0.254: R3.1 91.55,32.52 95.99,32.52 97.32,33.85 C3.1 97.32,39.62 D2.2 ; C7.2 94.72,40.9 95.23,40.39 98.02,40.39 D2.2 ; D2.2 98.1,40.39 v1(99.67,40.39) ; 109.32,38.66 v1(109.32,39.76)
  Bottom Layer w0.254: v1(109.32,39.76) 108.69,40.39 v1(99.67,40.39)
$1N1359: length 10.3
  Top Layer w0.254: U5.2 U5.1 79.86,37.45 78.41,36 78.41,34.85 R7.1 79.2,34.79 79.61,34.39 79.61,32.19 78.88,31.46 TP2.1
$1N1368: length 8.9
  Top Layer w0.254: TP5.1 78.46,48.82 R6.1 78.85,46.99 81.89,43.95 81.89,42.9 U5.7 U5.6
$1N2562: length 14
  Top Layer w0.254: U5.3 83.2,35.91 83.93,35.18 86.72,35.18 87.48,34.42 R5.1 87.49,33.28 89.01,33.28 89.77,34.03 R3.2 91.54,36.02 TP1.1
$1N4779: length 7.4
  Top Layer w0.254: R6.2 78.46,45.47 77.7,45.47 76.8,46.37 75.65,46.37 75.65,44.44 75.92,44.16 U1.1
$1N4819: length 7.4
  Top Layer w0.254: R7.2 77.47,33.29 76.69,34.07 75.53,34.07 C8.2 75.52,36.03 R12.1 75.57,36.62 75.92,36.97 U1.8
$1N4876: length 6.4
  Top Layer w0.254: 74.2,46.33 73.89,46.64 72.24,46.64 72.15,46.72 R4.2 ; 74.2,46.33 74.25,46.37 ; 74.2,46.33 74.2,44.38 73.97,44.15 U1.4
$1N4917: length 6
  Top Layer w0.254: 72.15,34.06 72.16,34.06 C8.1 74.12,36.03 R12.2 73.97,36.18 U1.5
$1N4995: length 15.2
  Top Layer w0.254: R8.3 82.4,46.36 84.56,44.2 84.56,42.94 U5.5 86.9,42.86 90.03,45.99 R11.2 91.54,43.97 TP6.1
$1N11430: length 27.7
  Top Layer w0.254: 91.56,27.9 91.58,27.92 93.47,27.92 94.77,26.62 94.77,25.04 ; 94.77,24.12 94.77,25.04 ; 94.77,25.04 95.85,26.12 98.06,26.12 97.32,26.86 C18.2 97.32,29.53 98.15,30.36 107.42,30.36 109.32,28.45 R22.2 ; C16.1 94.76,24.12
$1N11437: length 29.4
  Top Layer w0.254: 109.23,19.25 109.23,20.25 v1(109.22,20.26) ; v1(99.71,20.93) 98.54,20.93 98.53,20.92 ; R15.1 95.27,13.01 97.32,15.05 C12.1 97.32,20.2 D5.2 95.5,20.94 94.76,21.69 94.76,22.7
  Bottom Layer w0.254: v1(109.22,20.26) 108.56,20.93 v1(99.71,20.93)
$1N11444: length 9
  Top Layer w0.254: U6.2 U6.1 80.79,14.61 79.91,13.73 R19.1 78.46,12.07 78.58,11.95
$1N11445: length 9.3
  Top Layer w0.254: 78.55,27.33 79.47,27.33 82.03,24.78 82.03,23.25 ; 81.9,23.18 81.88,23.17 ; TP11.1 78.46,29.19 R18.1 ; 83.31,23.18 82.03,23.18
$1N11449: length 14
  Top Layer w0.254: U6.3 83.33,16.26 83.96,15.63 86.85,15.63 87.61,14.86 R17.1 89.51,13.72 90.15,14.36 91.44,14.36 R15.2 91.54,14.57 TP7.1
$1N11458: length 8.2
  Top Layer w0.254: U2.1 76.05,22.61 76.05,24.14 75.7,24.49 75.7,24.55 75.57,24.67 75.65,24.75 75.65,26.7 ; R18.2 78.46,25.15 77.96,24.64 75.6,24.64
$1N11459: length 7.6
  Top Layer w0.254: R24.1 76.78,16.04 77.57,15.24 78.46,15.24 ; R24.1 75.57,14.08 C17.2 ; R24.1 75.92,16.39 U2.8
$1N11460: length 6.4
  Top Layer w0.254: U2.4 73.97,24.83 R13.2 74.06,26.65 C10.1 72.65,26.83 72.41,27.08
$1N11461: length 6.4
  Top Layer w0.254: R21.2 72.16,14 C17.1 74.25,15.86 R24.2 73.97,16.13 U2.5
$1N11462: length 14
  Top Layer w0.254: 84.61,23.62 84.58,23.65 84.58,24.72 82.38,26.92 82.38,27.22 ; 91.49,24.28 90.44,23.23 84.66,23.23 ; 91.54,26.43 91.54,24.25
$1N12616: length 29.1
  Top Layer w0.254: v1(11.92,37.85) 10.47,37.85 R34.2 ; D8.1 22.14,39.2 C27.2 22.14,33.66 24.05,31.76 27.13,31.76 R35.1 ; D8.1 21.47,39.76 v1(19.92,39.76) ; D8.1 23.78,39.81 24.74,40.77 C25.1
  Bottom Layer w0.254: v1(19.92,39.76) 13.82,39.76 v1(11.92,37.85)
$1N12623: length 27
  Top Layer w0.254: 21.56,45.03 23.92,45.03 24.74,44.2 C25.2 ; 21.56,45.03 22.14,45.61 C21.1 ; 21.56,45.03 D8.2 ; R27.1 25.5,48 24.87,47.38 C21.1 ; R26.2 10.4,47.76 11.28,48.65 21.44,48.65 22.08,48.01 22.08,47.44 C21.1
$1N12630: length 8.9
  Top Layer w0.254: U7.2 U7.1 38.42,45.94 39.22,46.74 40.61,46.74 R31.1 40.62,48.35 TP14.1
$1N12631: length 9.1
  Top Layer w0.254: TP17.1 40.62,31.5 R30.1 40.61,33.28 39.73,33.28 37.06,35.95 37.06,36.2 37.15,36.29 U7.7 U7.6
$1N12635: length 13
  Top Layer w0.254: 27.42,46.5 27.42,46.62 27.42,46.61 30.08,46.61 30.33,46.87 R29.1 33.76,44.84 35.03,44.84 35.92,43.95 35.92,42.74 U7.3 ; 27.42,46.5 TP13.1 ; 27.42,46.5 R27.2
$1N12644: length 8
  Top Layer w0.254: 43.63,35.29 43.27,34.93 42.02,34.93 41.63,34.54 40.87,34.54 R30.2 ; 43.63,35.29 43.67,35.33 43.67,35.82 43.41,36.07 U3.1 ; 43.63,35.29 43.63,33.31 43.69,33.26
$1N12645: length 7.8
  Top Layer w0.254: R31.2 40.64,45.2 42.16,45.2 43.03,46.07 C26.2 43.76,46.02 R36.1 43.76,43.41 43.41,43.06 U3.8
$1N12646: length 6.9
  Top Layer w0.254: 47.31,33.4 47.17,33.26 45.09,33.26 45.09,35.24 45.14,35.29 45.06,35.37 45.06,36.2 45.36,36.5 U3.4
$1N12647: length 6.2
  Top Layer w0.254: 47.31,46.08 45.22,46.08 C26.1 45.27,46.02 R36.2 45.36,43.96 U3.5
$1N12648: length 14.6
  Top Layer w0.254: R35.2 27.42,35.24 TP18.1 27.65,35.29 29.64,37.29 U7.5 34.61,35.86 36.81,33.66 R32.3
$1N13802: length 29.6
  Top Layer w0.254: D11.1 21.55,20.45 24.11,20.45 24.79,21.13 C34.1 ; D11.1 21.42,20.33 v1(19.92,20.33) ; D11.1 22.27,19.61 C36.2 22.27,14.29 24.11,12.45 27.53,12.45 R47.1 ; v1(10.39,19.94) 10.39,18.85
  Bottom Layer w0.254: v1(10.39,19.94) 10.77,20.33 v1(19.92,20.33)
$1N13809: length 28.9
  Top Layer w0.254: 21.51,25.6 D11.2 ; 21.51,25.6 23.79,25.6 24.74,24.64 24.74,23.6 C34.2 ; 21.51,25.6 22.14,26.23 C30.1 ; R39.1 24.99,28.57 24.23,27.82 22.27,27.82 C30.1 ; R38.2 10.52,27.27 10.52,28.58 12.17,30.23 21.31,30.23 22.08,29.47 22.08,28.01 C30.1
$1N13816: length 8.5
  Top Layer w0.254: TP20.1 40.53,29.09 R43.1 40.5,27.44 39.86,27.44 38.46,26.04 38.46,23.36 U8.1 U8.2
$1N13817: length 8.9
  Top Layer w0.254: 35.84,17.86 37.11,17.86 37.11,16.09 39.47,13.73 R42.1 ; TP23.1 40.49,11.98 40.49,13.34
$1N13821: length 13
  Top Layer w0.254: U8.3 35.84,24.6 35.03,25.41 33,25.41 31.73,26.68 R41.1 27.91,27.31 R39.2 27.63,27.03 TP19.1
$1N13830: length 8.2
  Top Layer w0.254: R37.1 43.72,16.59 43.37,16.94 U4.1 ; R37.1 43.67,15.82 42.41,15.82 41.82,15.24 40.49,15.24 ; R37.1 43.76,15.82 C28.2
$1N13831: length 7.4
  Top Layer w0.254: R43.2 40.53,25.91 41.89,25.91 42.65,26.67 C35.2 43.52,24.71 R48.1 43.37,24.41 U4.8
$1N13832: length 7
  Top Layer w0.254: U4.4 45.32,15.97 45.22,15.87 45.22,13.92 ; 45.22,13.92 45.41,14.1 47.52,14.1 ; 45.22,13.92 C28.1
$1N13833: length 8.2
  Top Layer w0.254: C35.1 46.25,26.67 ; 46.25,26.67 47.38,26.67 47.39,26.66 ; 46.25,26.67 46.23,26.65 46.23,24.64 ; 46.23,24.64 46.23,23.21 45.72,22.7 U4.5 ; 46.23,24.64 46.23,24.63 R48.2
$1N13834: length 14.5
  Top Layer w0.254: R44.3 34.57,16.09 34.57,17.86 30.92,17.86 28.93,15.88 27.63,15.88 TP24.1 27.63,14.13 R47.2
$1N22134: length 3.2
  Top Layer w0.254: U9.1 58.86,13.43 59.44,14 59.44,15.33 C37.1
$1N22138: length 3.1
  Top Layer w0.254: U9.8 61.21,13.43 60.8,13.84 60.8,15.36 C37.2
$1N22159: length 3.9
  Top Layer w0.254: C42.2 63.88,14.76 63.5,14.38 63.5,13.18 63.09,12.78 U9.7

## Copper pours and planes (outline as drawn; the poured copper is in the pictures)
+3V3 on Top Layer: 108.44,9.21 110.04,9.21 110.04,8.07 108.44,8.07
GND on Top Layer: 4.83,8.93 6.43,8.93 6.43,7.79 4.83,7.79
GND on Top Layer: 17.53,8.93 19.13,8.93 19.13,7.79 17.53,7.79
GND on Top Layer: 100.84,8.93 102.44,8.93 102.44,7.79 100.84,7.79
GND on Top Layer: -3.43,55.53 121.28,55.53 121.28,-2.13 -3.43,-2.13
GND on Top Layer: 105.92,8.93 107.52,8.93 107.52,7.79 105.92,7.79
GND on Bottom Layer: 4.83,8.93 6.43,8.93 6.43,7.79 4.83,7.79
GND on Bottom Layer: -2.41,54.64 121.79,54.64 121.79,-1.37 -2.41,-1.37
GND on Bottom Layer: 105.92,8.93 107.52,8.93 107.52,7.79 105.92,7.79
GND on Bottom Layer: 17.53,8.93 19.13,8.93 19.13,7.79 17.53,7.79
GND on Bottom Layer: 100.84,8.93 102.44,8.93 102.44,7.79 100.84,7.79
GND on Inner1: -4.32,56.54 124.46,56.54 124.46,-10.51 -4.32,-10.51
GND on Inner2: -7.11,58.45 125.98,58.45 125.98,-11.91 -7.11,-11.91

Small or netless copper shapes (teardrops, artwork), in the pictures only: 600 on Top Layer, 45 on Bottom Layer

## Text on the board
Bottom Silkscreen Layer: GND | NEG | POS | DIF ADC FRONTEND V101 | SEMANTIC BOAT PROJECT | 3 | 2 | 1 | 0
Top Silkscreen Layer: GND | SNG | VOCM | VDDA | -0V2 | + | - | 2 | 3 | 0 | 1
